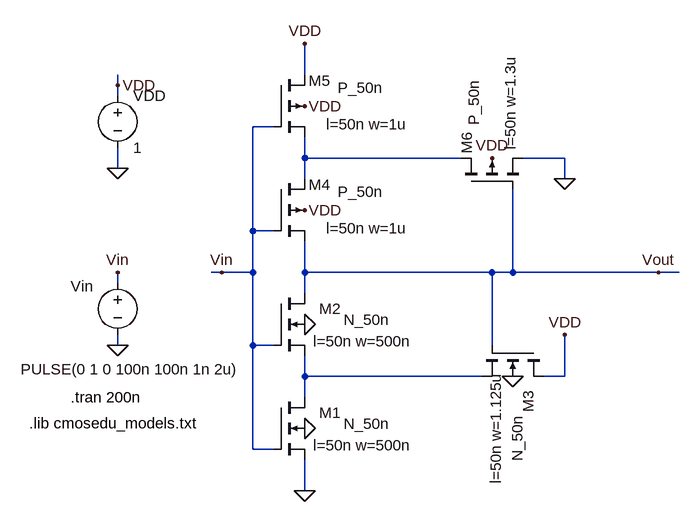
[diagram p0: schematic Fig18_5.asc]
Fig18_5.asc, the LTspice schematic file:
Version 4
SHEET 1 1136 680
WIRE 160 -496 160 -512
WIRE 160 -480 160 -496
WIRE 160 -368 160 -400
WIRE 160 -192 160 -208
WIRE 160 -96 160 -112
WIRE 320 -208 304 -208
WIRE 368 -272 368 -432
WIRE 368 -208 320 -208
WIRE 368 -208 368 -272
WIRE 368 -96 368 -208
WIRE 368 64 368 -96
WIRE 400 -432 368 -432
WIRE 400 -272 368 -272
WIRE 400 -96 368 -96
WIRE 400 64 368 64
WIRE 448 -512 448 -560
WIRE 448 -384 448 -416
WIRE 448 -352 448 -384
WIRE 448 -208 448 -256
WIRE 448 -176 448 -208
WIRE 448 -48 448 -80
WIRE 448 -16 448 -48
WIRE 448 128 448 80
WIRE 688 -384 448 -384
WIRE 720 -48 448 -48
WIRE 736 -208 448 -208
WIRE 736 -96 736 -208
WIRE 768 -208 736 -208
WIRE 768 -208 768 -336
WIRE 848 -384 784 -384
WIRE 848 -352 848 -384
WIRE 848 -48 816 -48
WIRE 848 -48 848 -112
WIRE 992 -208 768 -208
WIRE 1024 -208 992 -208
FLAG 160 -96 0
FLAG 160 -208 Vin
FLAG 448 32 0
FLAG 160 -368 0
FLAG 160 -496 VDD
FLAG 448 -464 VDD
FLAG 448 128 0
FLAG 448 -560 VDD
FLAG 320 -208 Vin
FLAG 448 -304 VDD
FLAG 448 -128 0
FLAG 992 -208 Vout
FLAG 736 -384 VDD
FLAG 768 -48 0
FLAG 848 -112 VDD
FLAG 848 -352 0
SYMBOL nmos4 400 -16 R0
WINDOW 0 104 24 Right 0
WINDOW 3 179 41 Right 0
WINDOW 123 213 74 Right 0
SYMATTR InstName M1
SYMATTR Value N_50n
SYMATTR Value2 l=50n w=500n
SYMBOL voltage 160 -208 R0
WINDOW 0 -72 21 Left 0
WINDOW 3 -149 149 Left 0
WINDOW 123 0 0 Left 0
WINDOW 39 0 0 Left 0
SYMATTR InstName Vin
SYMATTR Value PULSE(0 1 0 100n 100n 1n 2u)
SYMBOL voltage 160 -496 R0
WINDOW 123 0 0 Left 0
WINDOW 39 0 0 Left 0
SYMATTR InstName VDD
SYMATTR Value 1
SYMBOL pmos4 400 -512 R0
WINDOW 0 88 9 Right 0
WINDOW 3 168 20 Right 0
WINDOW 123 206 76 Right 0
SYMATTR InstName M5
SYMATTR Value P_50n
SYMATTR Value2 l=50n w=1u
SYMBOL pmos4 400 -352 R0
WINDOW 0 88 9 Right 0
WINDOW 3 168 20 Right 0
WINDOW 123 206 76 Right 0
SYMATTR InstName M4
SYMATTR Value P_50n
SYMATTR Value2 l=50n w=1u
SYMBOL nmos4 400 -176 R0
WINDOW 0 104 24 Right 0
WINDOW 3 179 41 Right 0
WINDOW 123 213 74 Right 0
SYMATTR InstName M2
SYMATTR Value N_50n
SYMATTR Value2 l=50n w=500n
SYMBOL pmos4 688 -336 R270
WINDOW 0 88 9 Right 0
WINDOW 3 168 20 Right 0
WINDOW 123 206 76 Right 0
SYMATTR InstName M6
SYMATTR Value P_50n
SYMATTR Value2 l=50n w=1.3u
SYMBOL nmos4 816 -96 R90
WINDOW 0 104 24 Right 0
WINDOW 3 179 41 Right 0
WINDOW 123 213 74 Right 0
SYMATTR InstName M3
SYMATTR Value N_50n
SYMATTR Value2 l=50n w=1.125u
TEXT 88 -16 Left 0 !.tran 200n
TEXT 24 24 Left 0 !.lib cmosedu_models.txt

The netlist it stands for:
* Fig18_5.asc
M1 N002 Vin 0 0 N_50n l=50n w=500n
Vin Vin 0 PULSE(0 1 0 100n 100n 1n 2u)
VDD VDD 0 1
M5 VDD Vin N001 VDD P_50n l=50n w=1u
M4 N001 Vin Vout VDD P_50n l=50n w=1u
M2 Vout Vin N002 0 N_50n l=50n w=500n
M6 N001 Vout 0 VDD P_50n l=50n w=1.3u
M3 VDD Vout N002 0 N_50n l=50n w=1.125u
.model NMOS NMOS
.model PMOS PMOS
.lib standard.mos
.tran 200n
.lib cmosedu_models.txt
.backanno
.end